# EAGLE design MotorDriver (EAGLE 8.4.3)
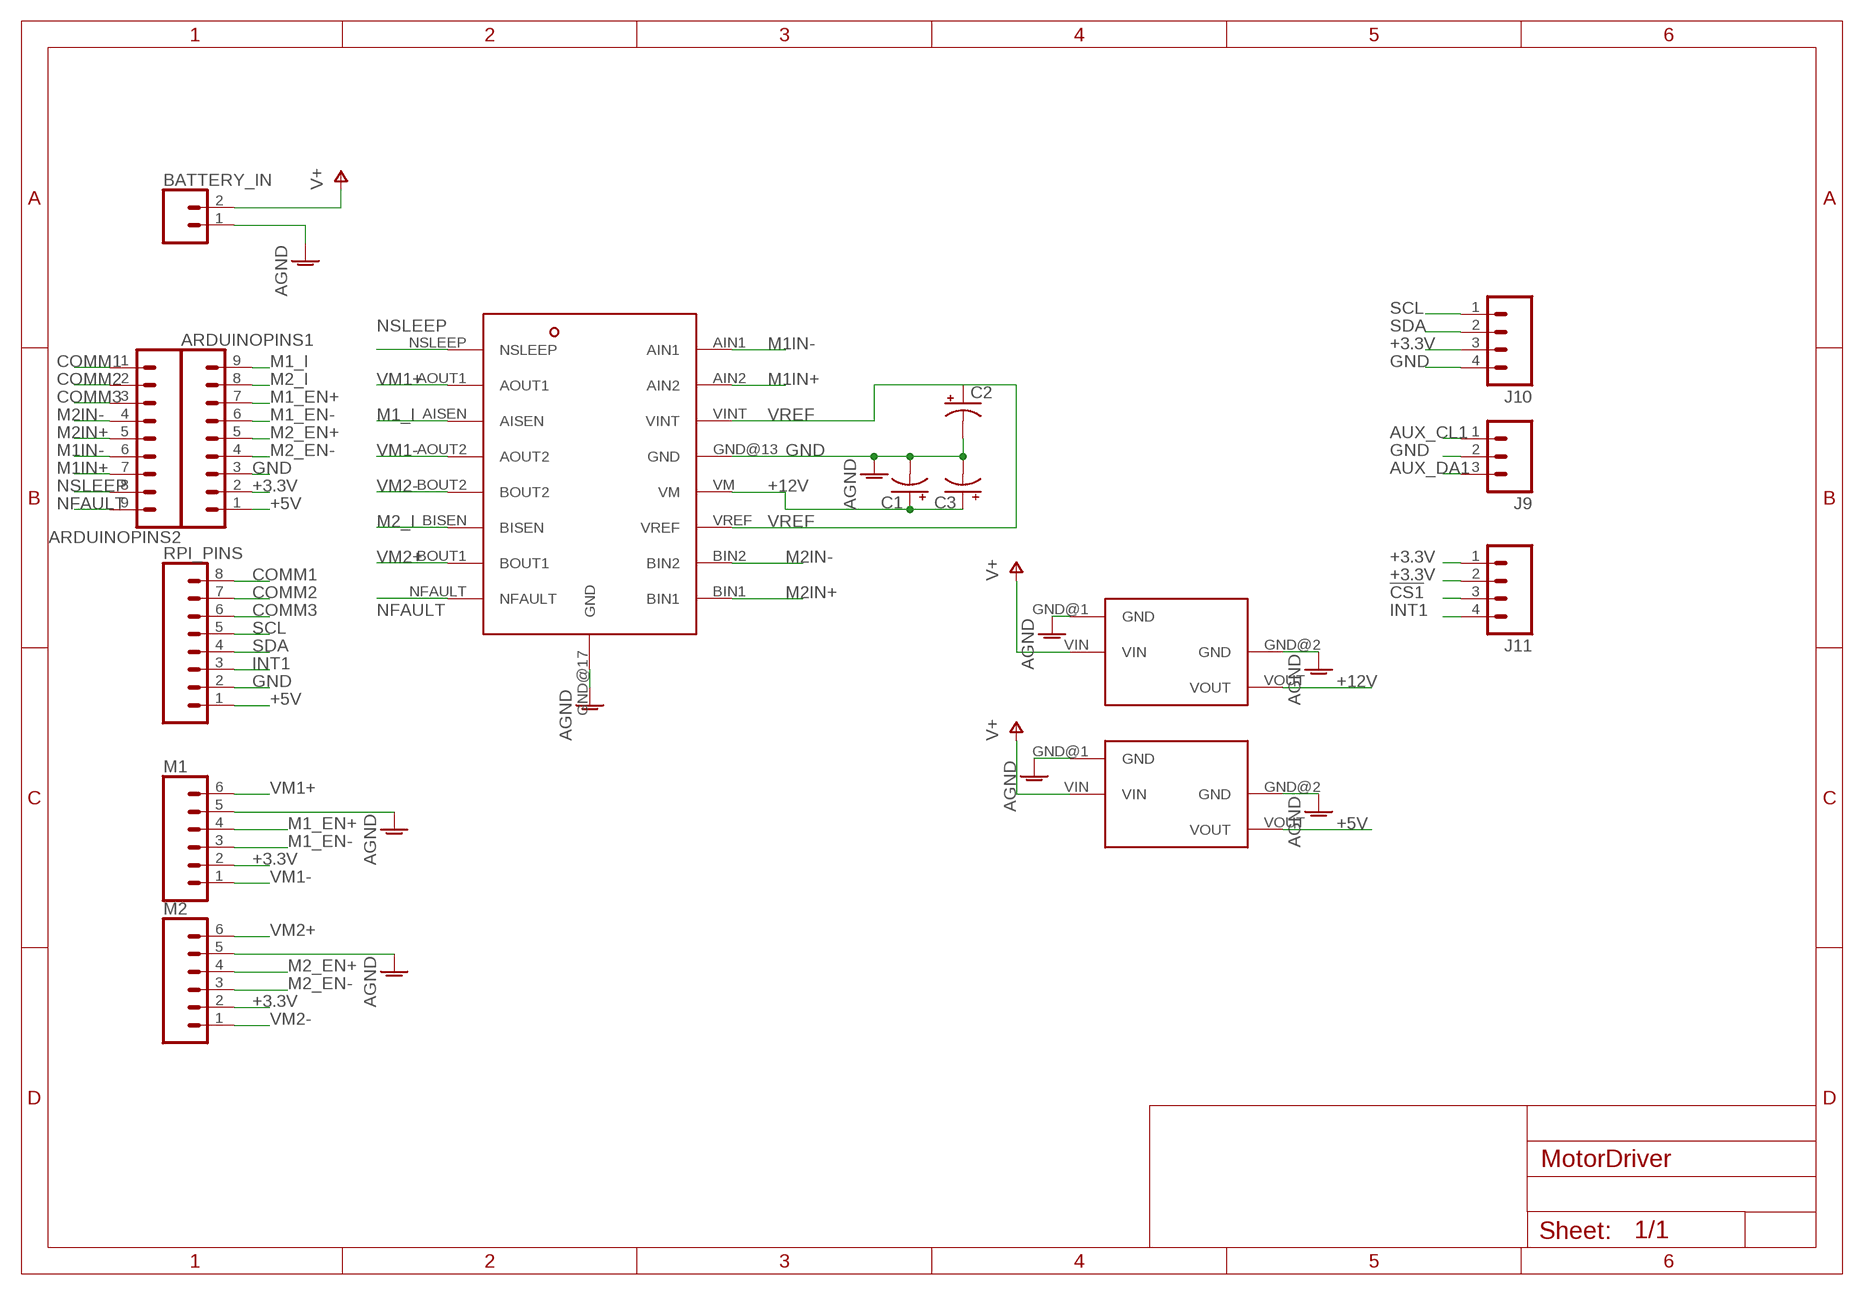
[diagram p0: schematic, sheet 1]

## Parts
ARDUINOPINS1  CONN_09  [1X09]
ARDUINOPINS2  CONN_09  [1X09]
BATTERY_IN  CONN_02  [1X02]
C1  CPOL-USTT2D5  [TT2D5]
C2  CPOL-USTT2D5  [TT2D5]
C3  CPOL-USTT2D5  [TT2D5]
HBRIDGE  DRV8848  [DRV8848]
J9  M03PTH  [1X03]
J10  M04PTH  [1X04]
J11  M04PTH  [1X04]
M1  CONN_06SILK_FEMALE_PTH  [1X06]
M2  CONN_06SILK_FEMALE_PTH  [1X06]
RPI_PINS  CONN_08"  [1X08]
VREG_5V  U3V50F12  [U3V50F12]
VREG_12V  U3V50F12  [U3V50F12]

## Nets
!CS1: J11.3
+3.3V: ARDUINOPINS1.2 J10.3 J11.1 J11.2 M1.2 M2.2
+5V: ARDUINOPINS1.1 RPI_PINS.1 VREG_5V.VOUT
+12V: C1.+ C3.+ HBRIDGE.VM VREG_12V.VOUT
AUX_CL1: J9.1
AUX_DA1: J9.3
COMM1: ARDUINOPINS2.1 RPI_PINS.8
COMM2: ARDUINOPINS2.2 RPI_PINS.7
COMM3: ARDUINOPINS2.3 RPI_PINS.6
GND: ARDUINOPINS1.3 BATTERY_IN.1 C1.- C2.- C3.- HBRIDGE.GND@13(GND) HBRIDGE.GND@17(GND) J9.2 J10.4 M1.5 M2.5 RPI_PINS.2 VREG_5V.GND@1(GND) VREG_5V.GND@2(GND) VREG_12V.GND@1(GND) VREG_12V.GND@2(GND) ; supply symbol labelled AGND
INT1: J11.4 RPI_PINS.3
M1_EN+: ARDUINOPINS1.7 M1.4
M1_EN-: ARDUINOPINS1.6 M1.3
M1_I: ARDUINOPINS1.9 HBRIDGE.AISEN
M1IN+: ARDUINOPINS2.7 HBRIDGE.AIN2
M1IN-: ARDUINOPINS2.6 HBRIDGE.AIN1
M2_EN+: ARDUINOPINS1.5 M2.4
M2_EN-: ARDUINOPINS1.4 M2.3
M2_I: ARDUINOPINS1.8 HBRIDGE.BISEN
M2IN+: ARDUINOPINS2.5 HBRIDGE.BIN1
M2IN-: ARDUINOPINS2.4 HBRIDGE.BIN2
NFAULT: ARDUINOPINS2.9 HBRIDGE.NFAULT
NSLEEP: ARDUINOPINS2.8 HBRIDGE.NSLEEP
SCL: J10.1 RPI_PINS.5
SDA: J10.2 RPI_PINS.4
V+: BATTERY_IN.2 VREG_5V.VIN VREG_12V.VIN
VM1+: HBRIDGE.AOUT1 M1.6
VM1-: HBRIDGE.AOUT2 M1.1
VM2+: HBRIDGE.BOUT1 M2.6
VM2-: HBRIDGE.BOUT2 M2.1
VREF: C2.+ HBRIDGE.VINT HBRIDGE.VREF

## Library data of the parts
ARDUINOPINS1 ARDUINOPINS2 = SparkFun-Connectors:CONN_09: Multi connection point. Often used as Generic Header-pin footprint for 0.1 inch spaced/style header connections On any of the 0.1 inch spaced packages, you can populate with these: Break Away Headers - Straight <https://www.sparkfun.com/products/116> (PRT-00116) Break Away Male Headers - Right Angle <https://www.sparkfun.com/products/553> (PRT-00553) Female Headers <https://www.sparkfun.com/products/115> (PRT-00115) Break Away Headers - Machine Pin <https://www.sparkfun.com/products/117> (PRT-00117) Break Away Female Headers - Swiss Machine Pin <https://www.sparkfun.com/products/743> (PRT-00743) For SCREWTERMINALS and SPRING TERMINALS visit here: Screw Terimnals on SparkFun.com <https://www.sparkfun.com/search/results?term=Screw+Terminals> (5mm/3.5mm/2.54mm spacing) This device is also useful as a general connection point to wire up your design to another part of your project. Our various solder wires solder well into these plated through hole pads. Hook-Up Wire - Assortment (Stranded, 22 AWG) <https://www.sparkfun.com/products/11375> (PRT-11375) Hook-Up Wire - Assortment (Solid Core, 22 AWG) <https://www.sparkfun.com/products/11367> (PRT-11367) View the entire wire category on our website here <https://www.sparkfun.com/categories/141> Special notes: Molex polarized connector foot print use with SKU : PRT-08231 with associated crimp pins and housings. 1MM SMD Version SKU: PRT-10208 NOTES ON THE VARIANTS LOCK and LOCK_LONGPADS... This footprint was designed to help hold the alignment of a through-hole component (i.e. 6-pin header) while soldering it into place. You may notice that each hole has been shifted either up or down by 0.005 of an inch from it's more standard position (which is a perfectly straight line). This slight alteration caused the pins (the squares in the middle) to touch the edges of the holes. Because they are alternating, it causes a "brace" to hold the component in place. 0.005 has proven to be the perfect amount of "off-center" position when using our standard breakaway headers. Although looks a little odd when you look at the bare footprint, once you have a header in there, the alteration is very hard to notice. Also,if you push a header all the way into place, it is covered up entirely on the bottom side.
BATTERY_IN = SparkFun-Connectors:CONN_02: Multi connection point. Often used as Generic Header-pin footprint for 0.1 inch spaced/style header connections On any of the 0.1 inch spaced packages, you can populate with these: Break Away Headers - Straight <https://www.sparkfun.com/products/116> (PRT-00116) Break Away Male Headers - Right Angle <https://www.sparkfun.com/products/553> (PRT-00553) Female Headers <https://www.sparkfun.com/products/115> (PRT-00115) Break Away Headers - Machine Pin <https://www.sparkfun.com/products/117> (PRT-00117) Break Away Female Headers - Swiss Machine Pin <https://www.sparkfun.com/products/743> (PRT-00743) For SCREWTERMINALS and SPRING TERMINALS visit here: Screw Terimnals on SparkFun.com <https://www.sparkfun.com/search/results?term=Screw+Terminals> (5mm/3.5mm/2.54mm spacing) This device is also useful as a general connection point to wire up your design to another part of your project. Our various solder wires solder well into these plated through hole pads. Hook-Up Wire - Assortment (Stranded, 22 AWG) <https://www.sparkfun.com/products/11375> (PRT-11375) Hook-Up Wire - Assortment (Solid Core, 22 AWG) <https://www.sparkfun.com/products/11367> (PRT-11367) View the entire wire category on our website here <https://www.sparkfun.com/categories/141> Special notes: Molex polarized connector foot print use with: PRT-08233 with associated crimp pins and housings. 2.54_SCREWTERM for use with PRT-10571. 3.5mm Screw Terminal footprints for PRT-08084 5mm Screw Terminal footprints for use with PRT-08432
C1-C3 = rcl:CPOL-US: POLARIZED CAPACITOR, American symbol
HBRIDGE = RoboLib:DRV8848
J9 = SparkFun-Connectors:M03: Header 3 Standard 3-pin 0.1" header. Use with straight break away headers (SKU : PRT-00116), right angle break away headers (PRT-00553), swiss pins (PRT-00743), machine pins (PRT-00117), and female headers (PRT-00115). Molex polarized connector foot print use with SKU : PRT-08232 with associated crimp pins and housings.
J10 J11 = SparkFun-Connectors:M04: Header 4 Standard 4-pin 0.1" header. Use with straight break away headers (SKU : PRT-00116), right angle break away headers (PRT-00553), swiss pins (PRT-00743), machine pins (PRT-00117), and female headers (PRT-00115). Molex polarized connector foot print use with SKU : PRT-08231 with associated crimp pins and housings. 1MM SMD Version SKU: PRT-10208; PROD_ID: CONN-09696
M1 M2 = SparkFun-Connectors:CONN_06: Multi connection point. Often used as Generic Header-pin footprint for 0.1 inch spaced/style header connections On any of the 0.1 inch spaced packages, you can populate with these: Break Away Headers - Straight <https://www.sparkfun.com/products/116> (PRT-00116) Break Away Male Headers - Right Angle <https://www.sparkfun.com/products/553> (PRT-00553) Female Headers <https://www.sparkfun.com/products/115> (PRT-00115) Break Away Headers - Machine Pin <https://www.sparkfun.com/products/117> (PRT-00117) Break Away Female Headers - Swiss Machine Pin <https://www.sparkfun.com/products/743> (PRT-00743) Arduino Stackable Header - 6 Pin <https://www.sparkfun.com/products/9280> (PRT-09280) For SCREWTERMINALS and SPRING TERMINALS visit here: Screw Terimnals on SparkFun.com <https://www.sparkfun.com/search/results?term=Screw+Terminals> (5mm/3.5mm/2.54mm spacing) This device is also useful as a general connection point to wire up your design to another part of your project. Our various solder wires solder well into these plated through hole pads. Hook-Up Wire - Assortment (Stranded, 22 AWG) <https://www.sparkfun.com/products/11375> (PRT-11375) Hook-Up Wire - Assortment (Solid Core, 22 AWG) <https://www.sparkfun.com/products/11367> (PRT-11367) View the entire wire category on our website here <https://www.sparkfun.com/categories/141>; PROD_ID: CONN-08437
RPI_PINS = SparkFun-Connectors:CONN_08: Multi connection point. Often used as Generic Header-pin footprint for 0.1 inch spaced/style header connections On any of the 0.1 inch spaced packages, you can populate with these: Break Away Headers - Straight <https://www.sparkfun.com/products/116> (PRT-00116) Break Away Male Headers - Right Angle <https://www.sparkfun.com/products/553> (PRT-00553) Female Headers <https://www.sparkfun.com/products/115> (PRT-00115) Break Away Headers - Machine Pin <https://www.sparkfun.com/products/117> (PRT-00117) Break Away Female Headers - Swiss Machine Pin <https://www.sparkfun.com/products/743> (PRT-00743) Arduino Stackable Header - 8 Pin <https://www.sparkfun.com/products/9279> (PRT-09279) For SCREWTERMINALS and SPRING TERMINALS visit here: Screw Terimnals on SparkFun.com <https://www.sparkfun.com/search/results?term=Screw+Terminals> (5mm/3.5mm/2.54mm spacing) This device is also useful as a general connection point to wire up your design to another part of your project. Our various solder wires solder well into these plated through hole pads. Hook-Up Wire - Assortment (Stranded, 22 AWG) <https://www.sparkfun.com/products/11375> (PRT-11375) Hook-Up Wire - Assortment (Solid Core, 22 AWG) <https://www.sparkfun.com/products/11367> (PRT-11367) View the entire wire category on our website here <https://www.sparkfun.com/categories/141> Special notes: Molex polarized connector foot print use with SKU : PRT-08231 with associated crimp pins and housings. 1MM SMD Version SKU: PRT-10208 NOTES ON THE VARIANTS LOCK and LOCK_LONGPADS... This footprint was designed to help hold the alignment of a through-hole component (i.e. 6-pin header) while soldering it into place. You may notice that each hole has been shifted either up or down by 0.005 of an inch from it's more standard position (which is a perfectly straight line). This slight alteration caused the pins (the squares in the middle) to touch the edges of the holes. Because they are alternating, it causes a "brace" to hold the component in place. 0.005 has proven to be the perfect amount of "off-center" position when using our standard breakaway headers. Although looks a little odd when you look at the bare footprint, once you have a header in there, the alteration is very hard to notice. Also,if you push a header all the way into place, it is covered up entirely on the bottom side.; PROD_ID: CONN-08438
VREG_5V VREG_12V = RoboLib:U3V50F12

## Board
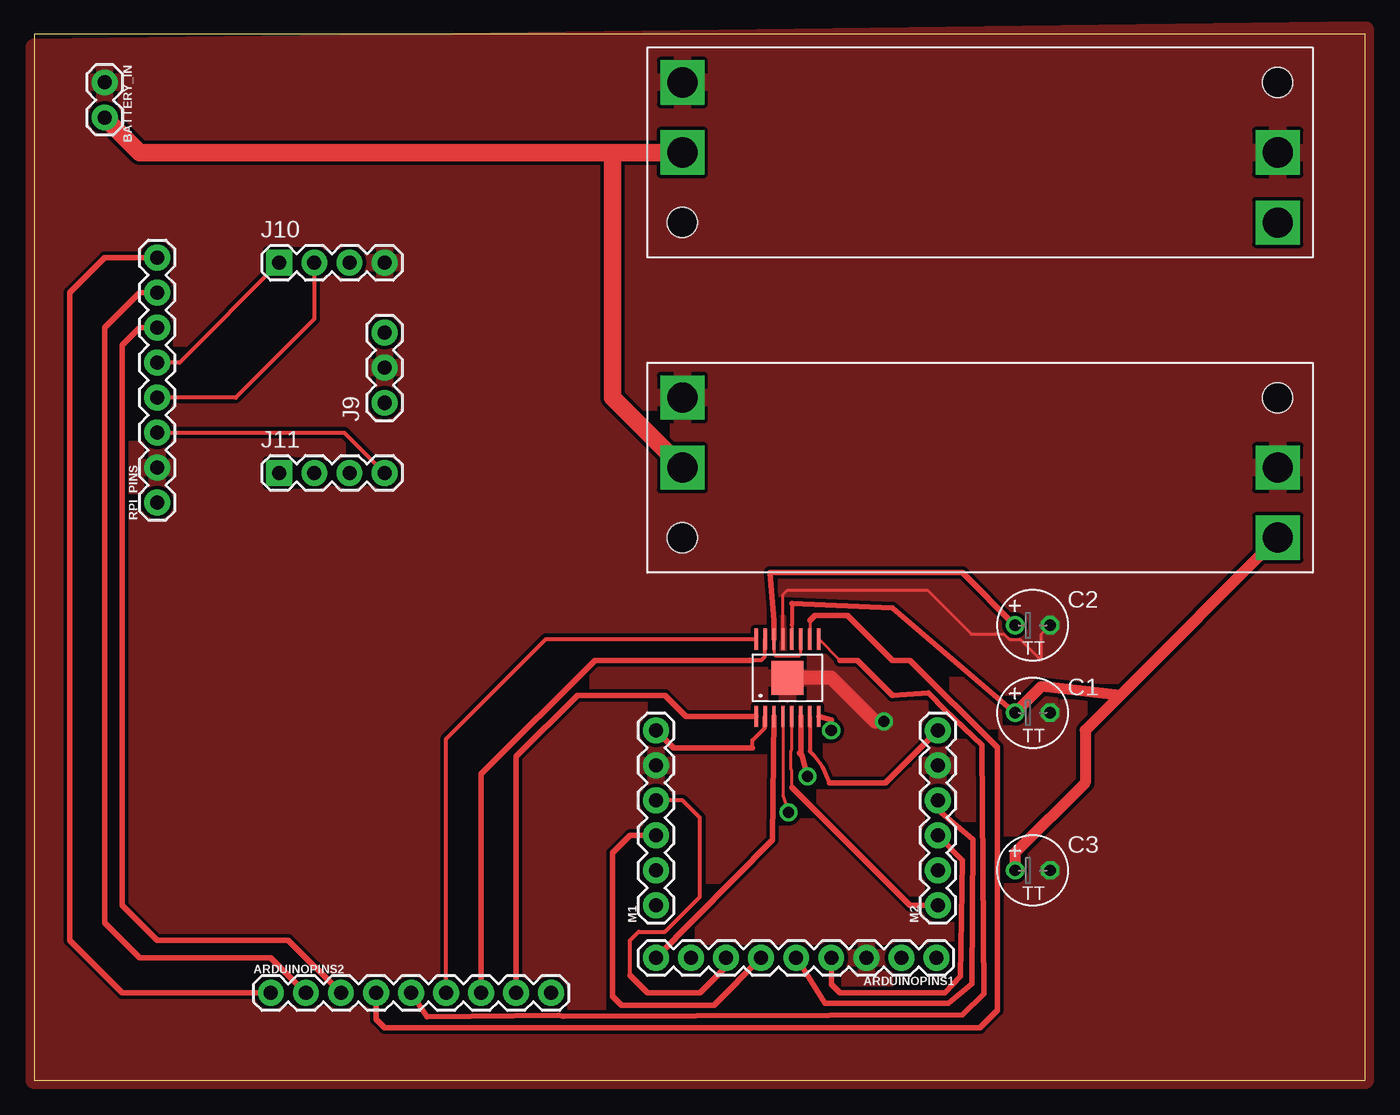
[diagram p1: board, top side]
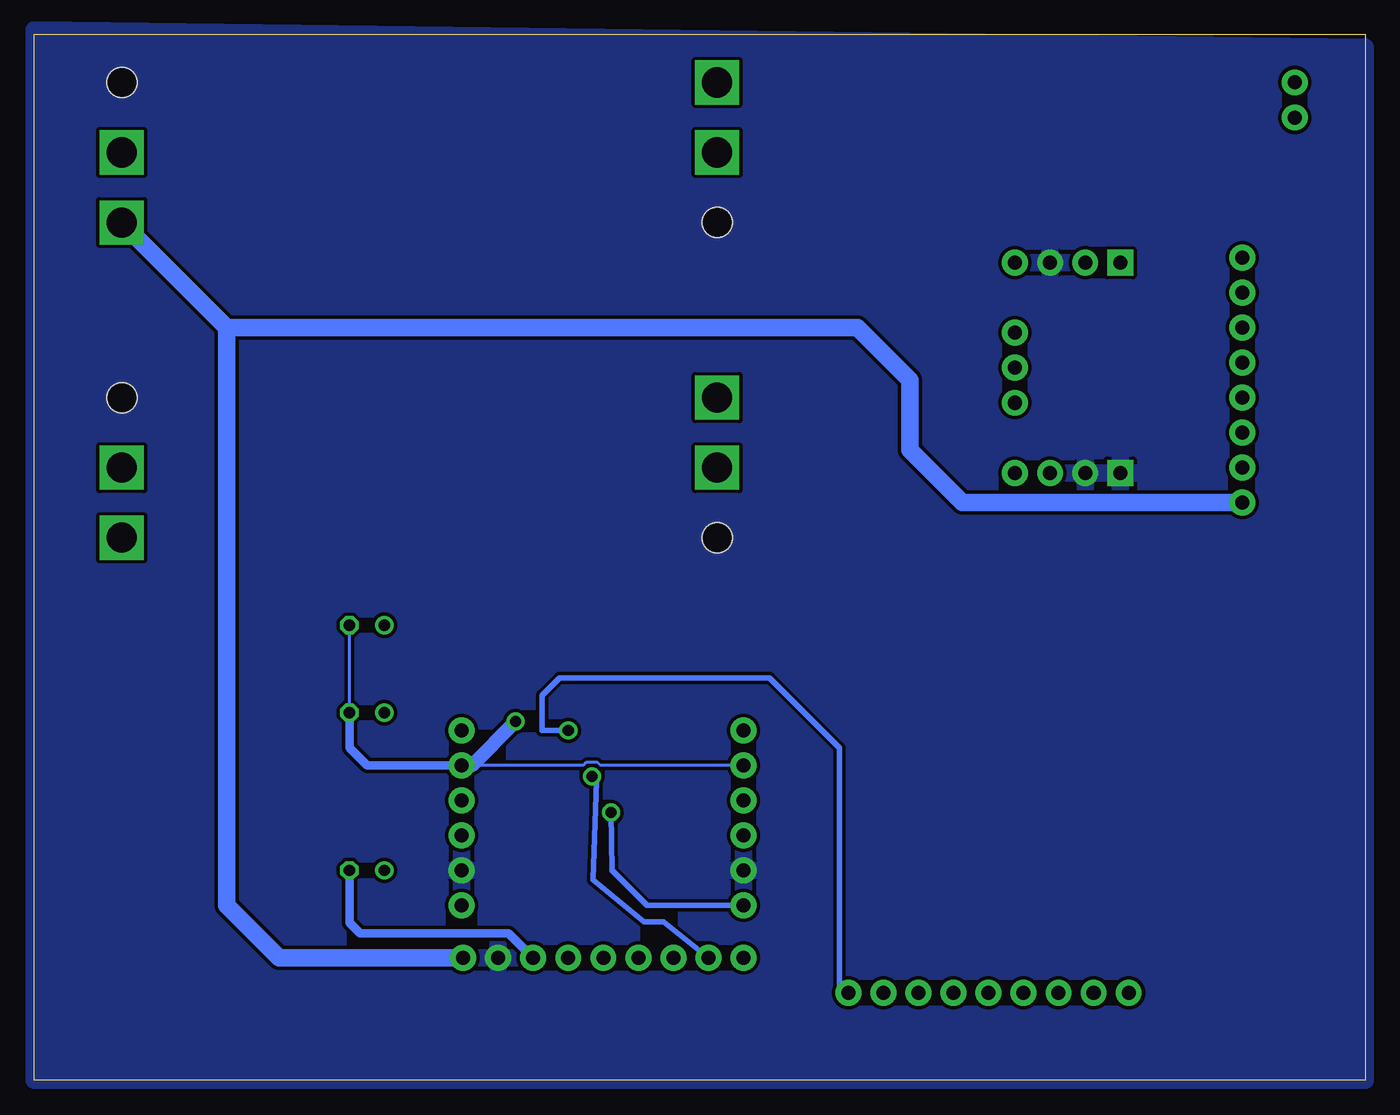
[diagram p2: board, bottom side, seen from below]

Size 96.5 x 75.87 mm. Coordinates in mm from the lower left corner, seen from the top.
Outline: 0,0 96.5,0 96.5,75.87 0,75.87 0,0
Copper layers (1*16): Top 0.035mm / dielectric 1.5mm / Bottom 0.035mm
Design rules "OthermillDRC_1_100_v2": minimum track width 8mil, minimum drill 0.8mm, track to track 0.256540625mm, track to pad 0.256540625mm, pad to pad 0.256540625mm, via to via 0.256540625mm, smd to smd 0mil, copper to edge 0mil, drill to drill 1mil, minimum pad ring 10mil, minimum via ring 10mil, stop-mask expansion 1mil, vias tented up to drill 30mil, thermal gap 10mil

### Footprints (pad centres in the part's own frame; a part is rotated, then mirrored left to right if it is on the bottom)
1X09 = drill 1.016 pad 1.88: 1 0,0; 2 2.54,0; 3 5.08,0; 4 7.62,0; 5 10.16,0; 6 12.7,0; 7 15.24,0; 8 17.78,0; 9 20.32,0
1X02 = drill 1.016 pad 1.88: 1 0,0; 2 2.54,0
TT2D5 = drill 0.813: + -1.27,0 | drill 0.813 octagon: - 1.27,0
DRV8848 = smd 0.25 x 1.55: AIN1 2.275,-2.8; AIN2 1.625,-2.8; AISEN 0.975,2.8; AOUT1 1.625,2.8; AOUT2 0.325,2.8; BIN1 -2.275,-2.8; BIN2 -1.625,-2.8; BISEN -0.975,2.8; BOUT1 -1.625,2.8; BOUT2 -0.325,2.8; GND@13 0.325,-2.8; NFAULT -2.275,2.8; NSLEEP 2.275,2.8; VINT 0.975,-2.8; VM -0.325,-2.8; VREF -0.975,-2.8 | smd 2.31 x 2.46: GND@17 0,0
1X03 = drill 1.016 pad 1.88: 1 0,0; 2 2.54,0; 3 5.08,0
1X04 = drill 1.016 pad 1.88 square: 1 0,0 | drill 1.016 pad 1.88: 2 2.54,0; 3 5.08,0; 4 7.62,0
1X06 = drill 1.016 pad 1.88: 1 0,0; 2 2.54,0; 3 5.08,0; 4 7.62,0; 5 10.16,0; 6 12.7,0
1X08 = drill 1.016 pad 1.88: 1 0,0; 2 2.54,0; 3 5.08,0; 4 7.62,0; 5 10.16,0; 6 12.7,0; 7 15.24,0; 8 17.78,0
U3V50F12 = drill 2.184 square: GND@1 -21.59,5.08; GND@2 21.59,0; VIN -21.59,0; VOUT 21.59,-5.08 | hole 2.184: -21.59,-5.08; 21.59,5.08

### Placement (x,y rotation side)
ARDUINOPINS1  65.41,8.89 180 top
ARDUINOPINS2  17.14,6.35 0 top
BATTERY_IN  5.08,72.39 270 top
C1  72.39,26.67 0 top
C2  72.39,33.02 0 top
C3  72.39,15.24 0 top
HBRIDGE  54.61,29.21 180 top
J9  25.38,49.15 90 top
J10  17.76,59.31 0 top
J11  17.76,44.07 0 top
M1  45.09,12.7 90 top
M2  65.53,12.7 90 top
RPI_PINS  8.89,41.91 90 top
VREG_5V  68.58,67.31 0 top
VREG_12V  68.58,44.45 0 top

### Tracks (layer width: path | path; a pad name or v marks a point on that pad's centre or on a via)
+3.3V
  pour Bottom: 0,74.93 0,0 96.52,0 96.52,76.2
+5V
  Bottom 1.27: VREG_5V.VOUT 82.55,54.61 | 82.55,54.61 36.83,54.61 33.02,50.8 33.02,45.72 29.21,41.91 RPI_PINS.1 | 82.55,54.61 82.55,12.7 78.74,8.89 ARDUINOPINS1.1
+12V
  Top 0.203: 54.94,33.04 HBRIDGE.VM
  Top 0.305: 54.94,34.62 54.94,33.04
  Top 0.406: C1.+ 62.23,34.29 54.94,34.62
  Top 0.813: VREG_12V.VOUT 78.74,27.94 | 78.74,27.94 73.03,28.57 C1.+ | 78.74,27.94 76.2,25.4 76.2,21.59 71.12,16.51 C3.+
COMM1
  Top 0.406: RPI_PINS.8 5.08,59.69 2.54,57.15 2.54,10.16 6.35,6.35 ARDUINOPINS2.1
COMM2
  Top 0.406: ARDUINOPINS2.2 17.14,8.89 7.62,8.89 5.08,11.43 5.08,54.61 7.62,57.15 RPI_PINS.7
COMM3
  Top 0.406: RPI_PINS.6 7.62,54.61 6.35,53.34 6.35,12.7 8.89,10.16 18.41,10.16 ARDUINOPINS2.3
GND  (via drill 0.8)
  Top 0.203: HBRIDGE.GND@13 54.28,35.23 54.61,35.56 64.77,35.56 67.94,32.38 70.31,32.38 70.7,32 71.5,32 73.03,30.48 73.03,32.38 C2.-
  Top 1.016: v61.59,26.04 60.96,26.04 57.78,29.21 HBRIDGE.GND@17
  Bottom 0.203: M1.5 55.46,22.86 55.66,23.06 56.49,23.06 56.69,22.86 M2.5 | C1.- C2.-
  Bottom 0.61: ARDUINOPINS1.3 62.1,10.67 72.9,10.67 73.66,11.43 C3.- | C1.- 73.66,24.13 72.39,22.86 M2.5
  Bottom 1.016: M2.5 64.77,22.86 v61.59,26.04
  pour Top: 0,74.93 0,0 96.52,0 96.52,76.2
INT1
  Top 0.305: RPI_PINS.3 22.46,46.99 J11.4
M1_EN+
  Top 0.305: 43.18,7.62 43.18,10.16 43.81,10.79 45.72,10.79 48.26,13.34 48.26,19.05 46.99,20.32 M1.4
  Top 0.406: ARDUINOPINS1.7 50.16,8.26 48.26,6.35 44.45,6.35 43.18,7.62
M1_EN-
  Top 0.406: ARDUINOPINS1.6 49.28,5.46 42.57,5.46 41.91,6.12 41.91,16.51 43.18,17.78 M1.3
M1_I
  Top 0.406: HBRIDGE.AISEN 53.53,17.44 ARDUINOPINS1.9
M1IN+
  Top 0.305: HBRIDGE.AIN2 52.96,31.98 52.96,30.73 52.7,30.48 52.07,30.48
  Top 0.406: 52.07,30.48 40.64,30.48 32.38,22.23 ARDUINOPINS2.7
M1IN-
  Top 0.305: ARDUINOPINS2.6 29.84,24.77 37.09,32.01 HBRIDGE.AIN1
M2_EN+
  Top 0.406: M2.4 65.53,19.61 68.05,17.5 67.97,7.01 66.27,5.61 57.33,5.61 55.6,8.38 55.6,8.54 ARDUINOPINS1.5
M2_EN-
  Top 0.406: M2.3 67.31,15.98 67.16,7.54 66.04,6.35 58.42,6.35 57.78,6.99 ARDUINOPINS1.4
M2_I  (via drill 0.8)
  Top 0.406: HBRIDGE.BISEN 55.59,23.84 55.49,23.74 55.67,23.57 v56.08,22.05
  Bottom 0.406: ARDUINOPINS1.8 50.88,11.51 52.3,11.51 55.98,14.55 55.75,21.72 v56.08,22.05
M2IN+
  Top 0.203: 58.41,30.48 HBRIDGE.BIN1
  Top 0.406: 58.41,30.48 59.69,30.48 62.23,27.94 64.82,28.09 66.06,26.85 66.07,26.85 68.71,24.34 68.86,6.27 67.28,4.78 38.36,4.65 38,4.72 28.47,4.62 ARDUINOPINS2.5
M2IN-
  Top 0.203: 56.23,33.38 HBRIDGE.BIN2
  Top 0.406: 56.23,33.38 56.59,33.73 58.98,33.73 62.23,30.48 63.5,30.48 69.85,24.16 69.85,5.08 68.58,3.81 25.4,3.81 24.77,4.45 ARDUINOPINS2.4
NFAULT  (via drill 0.8)
  Top 0.406: HBRIDGE.NFAULT 57.78,26.14 v57.78,25.4
  Bottom 0.406: v57.78,25.4 59.69,25.4 59.69,27.94 58.42,29.21 43.18,29.21 38.1,24.13 38.1,6.99 ARDUINOPINS2.9
NSLEEP
  Top 0.406: HBRIDGE.NSLEEP 47.25,26.41 45.72,27.94 39.37,27.94 34.92,23.5 ARDUINOPINS2.8
SCL
  Top 0.305: J10.1 10.52,52.07 RPI_PINS.5
SDA
  Top 0.305: J10.2 20.3,55.23 14.61,49.53 RPI_PINS.4
V+
  Top 1.27: BATTERY_IN.2 7.62,67.31 41.91,67.31 | 41.91,67.31 VREG_5V.VIN | VREG_12V.VIN 41.91,49.53 41.91,67.31
VM1+
  Top 0.305: HBRIDGE.AOUT1 52.95,26.37 52.95,25.54 52.07,24.67 52.07,24.13
  Top 0.406: 52.07,24.13 46.35,24.13 M1.6
VM1-  (via drill 0.8)
  Top 0.203: HBRIDGE.AOUT2 54.28,20.64 v54.69,19.43
  Bottom 0.406: v54.69,19.43 54.61,15.24 52.07,12.7 M1.1
VM2+
  Top 0.305: HBRIDGE.BOUT1 56.23,23.87 56.51,23.6 57.14,22.76 57.67,21.59
  Top 0.406: M2.6 61.72,21.59 57.67,21.59
VM2-
  Top 0.203: 54.94,21.27 54.94,22.48 54.88,22.53 54.88,23.93 54.94,23.98 HBRIDGE.BOUT2
  Top 0.406: M2.1 63.5,12.7 54.94,21.27
VREF
  Top 0.203: HBRIDGE.VINT 53.63,30.92 53.76,30.8 55.49,30.8 55.59,30.9 HBRIDGE.VREF
  Top 0.406: C2.+ 67.31,36.83 53.34,36.83 53.63,33.31 HBRIDGE.VINT